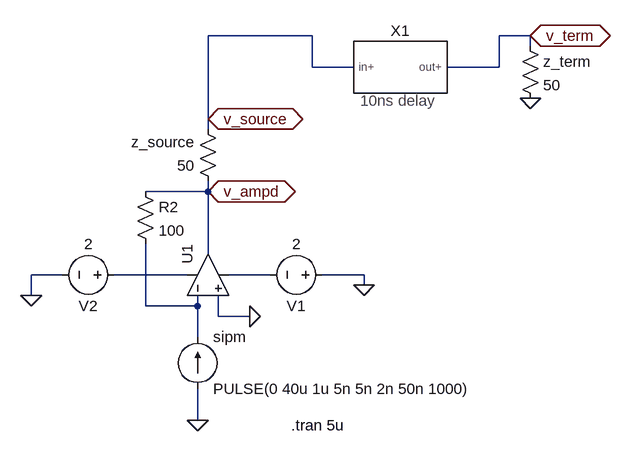
[diagram p0: schematic sipm-tia-delay-line.asc]
sipm-tia-delay-line.asc, the LTspice schematic file:
Version 4
SHEET 1 880 680
WIRE 192 16 32 16
WIRE 528 16 480 16
WIRE 528 32 528 16
WIRE 192 64 192 16
WIRE 256 64 192 64
WIRE 480 64 480 16
WIRE 480 64 400 64
WIRE 32 144 32 16
WIRE 32 160 32 144
WIRE 32 256 32 240
WIRE 32 256 -64 256
WIRE 32 352 32 256
WIRE -192 384 -240 384
WIRE 0 384 -112 384
WIRE 128 384 64 384
WIRE 272 384 208 384
WIRE 272 400 272 384
WIRE -240 416 -240 384
WIRE -64 432 -64 336
WIRE 16 432 16 416
WIRE 16 432 -64 432
WIRE 48 448 48 416
WIRE 96 448 48 448
WIRE 16 480 16 432
WIRE 16 608 16 560
FLAG 16 608 0
FLAG 528 112 0
FLAG 272 400 0
FLAG -240 416 0
FLAG 96 448 0
FLAG 32 256 v_ampd
IOPIN 32 256 BiDir
FLAG 32 144 v_source
IOPIN 32 144 BiDir
FLAG 528 16 v_term
IOPIN 528 16 BiDir
SYMBOL 10ns-delay 320 64 R0
SYMATTR InstName X1
SYMBOL res 48 256 R180
WINDOW 0 36 76 Left 2
WINDOW 3 36 40 Left 2
SYMATTR InstName z_source
SYMATTR Value 50
SYMBOL current 16 560 M180
WINDOW 0 24 80 Left 2
WINDOW 3 24 0 Left 2
WINDOW 123 0 0 Left 0
WINDOW 39 0 0 Left 0
SYMATTR InstName sipm
SYMATTR Value PULSE(0 40u 1u 5n 5n 2n 50n 1000)
SYMBOL OpAmps\\UniversalOpAmp 32 384 R270
SYMATTR InstName U1
SYMATTR Value2 Avol=1Meg GBW=1000Meg Vos=0
SYMBOL voltage 224 384 R90
WINDOW 0 32 56 VTop 2
WINDOW 3 -32 56 VBottom 2
WINDOW 123 0 0 Left 0
WINDOW 39 0 0 Left 0
SYMATTR InstName V1
SYMATTR Value 2
SYMBOL voltage -96 384 R90
WINDOW 0 32 56 VTop 2
WINDOW 3 -32 56 VBottom 2
WINDOW 123 0 0 Left 0
WINDOW 39 0 0 Left 0
SYMATTR InstName V2
SYMATTR Value 2
SYMBOL res -80 240 R0
SYMATTR InstName R2
SYMATTR Value 100
SYMBOL res 512 16 R0
SYMATTR InstName z_term
SYMATTR Value 50
TEXT 160 616 Left 2 !.tran 5u

The netlist it stands for:
* sipm-tia-delay-line.asc
XX1 v_source v_term 10ns-delay  ; pins in+ out+
R§z_source v_ampd v_source 50
I§sipm 0 N003 PULSE(0 40u 1u 5n 5n 2n 50n 1000)
XU1 0 N003 N001 N002 v_ampd level1 Avol=1Meg GBW=1000Meg Vos=0 En=0 Enk=0 In=0 Ink=0 Rin=500Meg  ; pins In+ In- V+ V- OUT
V1 0 N002 2
V2 N001 0 2
R2 v_ampd N003 100
R§z_term v_term 0 50
.tran 5u
.lib UniversalOpAmp1.lib
.backanno
.end